# EAGLE design PzemBoard (EAGLE 8.6.0)
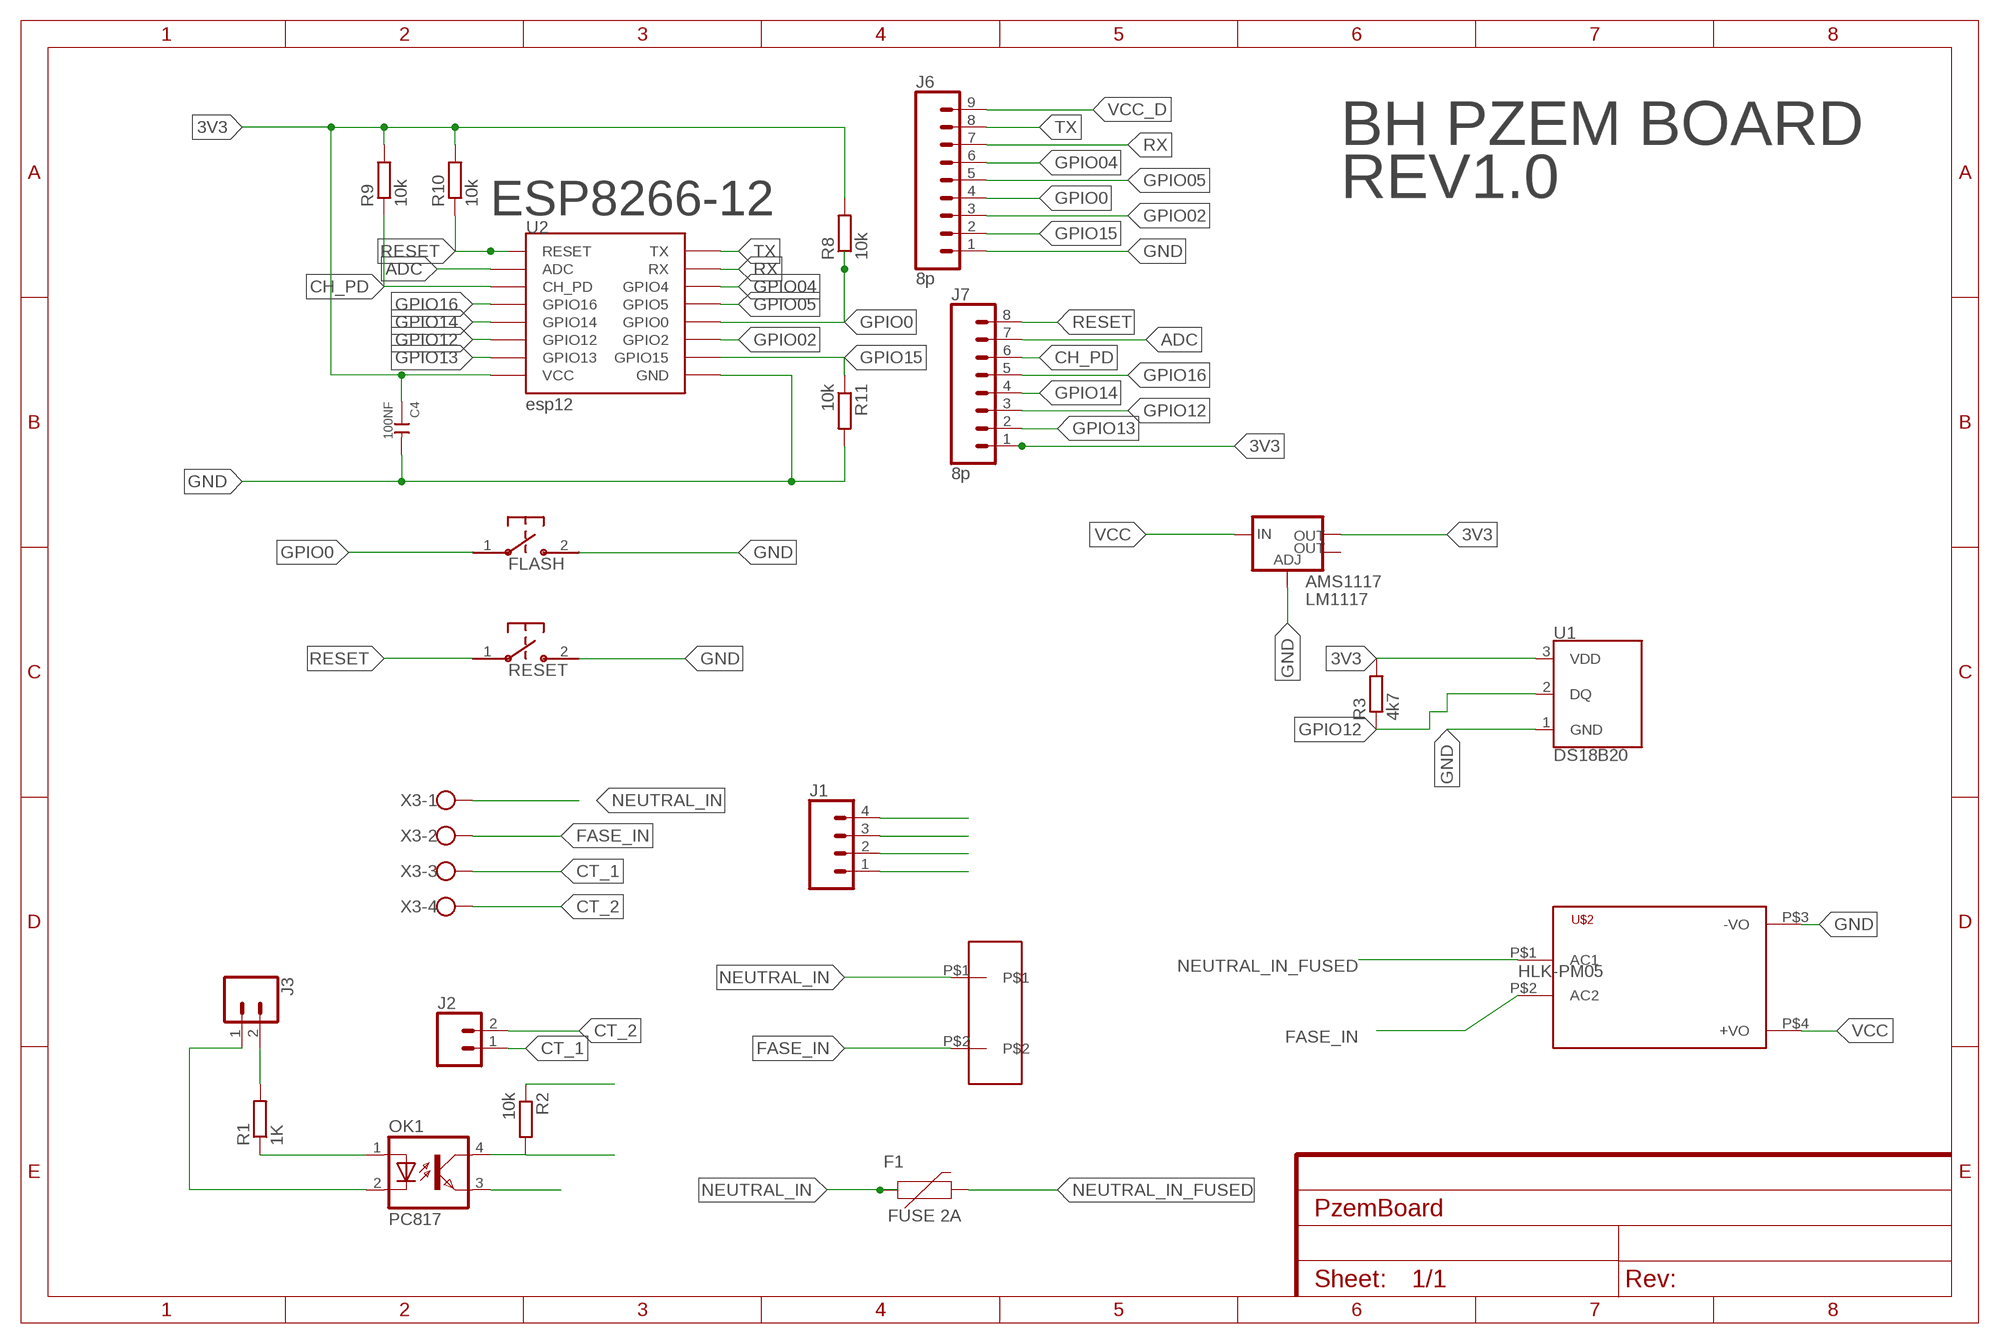
[diagram p0: schematic, sheet 1]

## Parts
AMS1117  LM1117  V_REG_LM1117SOT223  [SOT223]
C4  100NF  CERAMIC-1NF-1KV-10%-X7R(1206)  [C1206]
F1  FUSE 2A  PPTC_PTH  [PTH]
FLASH  B3U-1000P-2P-SMD  B3U-1000P  [B3U-1000P]
J1  CONN_04  [1X04]
J2  CONN_02  [1X02]
J3  CONN_02  [1X02]
J6  8p  CONN_09  [1X09]
J7  8p  CONN_08"  [1X08]
OK1  PC817  [DIL04]
R1  1K  R-EU_R0603  [R0603]
R2  10k  R-EU_R0603  [R0603]
R3  4k7  R-EU_R0603  [R0603]
R8  10k  R-EU_R0603  [R0603]
R9  10k  R-EU_R0603  [R0603]
R10  10k  R-EU_R0603  [R0603]
R11  10k  R-EU_R0603  [R0603]
RESET  B3U-1000P-2P-SMD  B3U-1000P  [B3U-1000P]
U1  DS18B20  [TO-92-AMMO]
U2  esp12  ESP12SMD  [ESP12-SMD]
U$1  SCREWTERMINALS_5MM_2  [TERMINAL_2X]
U$2  HKLPM01  [HKLPM01]
X3  W237-4  [W237-4]

## Nets
3V3: AMS1117.2(OUT) C4.1 J7.1 R3.2 R8.2 R9.2 R10.2 U1.3(VDD) U2.VCC
ADC: J7.7 U2.ADC
CH_PD: J7.6 R9.1 U2.CH_PD
CT_1: J2.1 X3.3
CT_2: J2.2 X3.4
FASE_IN [220V]: U$1.P$2 U$2.P$2(AC2) X3.2
GND: AMS1117.1(ADJ) C4.2 FLASH.2 J1.4 J6.1 OK1.3(EMIT) R11.2 RESET.2 U1.1(GND) U2.GND U$2.P$3(-VO)
GPIO0: FLASH.1 J6.4 R8.1 U2.GPIO0
GPIO02: J6.3 U2.GPIO2
GPIO04: J1.2 J6.6 U2.GPIO4
GPIO05: J1.3 J6.5 U2.GPIO5
GPIO12: J7.3 R3.1 U1.2(DQ) U2.GPIO12
GPIO13: J7.2 U2.GPIO13
GPIO14: J7.4 OK1.4(COL) R2.2 U2.GPIO14
GPIO15: J6.2 R11.1 U2.GPIO15
GPIO16: J7.5 U2.GPIO16
N$1: OK1.1(A) R1.1
N$3: J3.2 R1.2
NEUTRAL_IN [220V]: F1.P$1 U$1.P$1 X3.1
NEUTRAL_IN_FUSED: F1.P$2 U$2.P$1(AC1)
RESET: J7.8 R10.1 RESET.1 U2.RESET
RX: J6.7 U2.RXD0(RX)
SIGNAL_GND: J3.1 OK1.2(C)
TX: J6.8 U2.TXD0(TX)
VCC: AMS1117.3(IN) R2.1 U$2.P$4(+VO)
VCC_D: J1.1 J6.9
Unconnected: AMS1117.4(OUT)

## Notes on the sheet
- BH PZEM BOARD
- REV1.0
- ESP8266-12
- HLK-PM05

## Library data of the parts
AMS1117 = SparkFun-IC-Power:V_REG_LM1117: Voltage Regulator LM1117 Standard adjustable voltage regulator but in SMD form. Spark Fun Electronics SKU : COM-00595; PROD_ID: VREG-08170
C4 = Seeed-Capacitor:CERAMIC-1NF-1KV-10%-X7R?(1206): 302010189; MPN: CC1206KKX7RCBB102; VALUE: 1NF
F1 = SparkFun-Fuses:PPTC: Resettable Fuse PPTC Resettable Fuse. Really a sort of resistor with a polymeric positive temperature coefficient whose resistance increases dramatically with an increase in temperature. When heated by the power passing through the resistance rises causing the current to be limited, protecting the circuit. This is achieved by the transition of the polymer from a crystalline to an amorphous state where the conductive carbon separates breaking the conductive pathways found in the cool crystalline structure. When a PPTC cools back down it resumes conducting letting the circuit turn back on. SparkFun Products: SparkFun RedBoard - Programmed with Arduino <https://www.sparkfun.com/products/12757> Pro Micro - 5V/16MHz <https://www.sparkfun.com/products/12640> Arduino Pro 328 - 5V/16MHz <https://www.sparkfun.com/products/10915> MP3 Trigger <https://www.sparkfun.com/products/13720>; PROD_ID: RES-08490; VALUE: 72V/0.25A
FLASH = switches:B3U: Switch; DIGIKEY: SW1020CT-ND; MANUFACTURER: Omron; MPN: B3U-1000P; SPICEPREFIX: F
J1 = SparkFun-Connectors:CONN_04: Multi connection point. Often used as Generic Header-pin footprint for 0.1 inch spaced/style header connections On any of the 0.1 inch spaced packages, you can populate with these: Break Away Headers - Straight <https://www.sparkfun.com/products/116> (PRT-00116) Break Away Male Headers - Right Angle <https://www.sparkfun.com/products/553> (PRT-00553) Female Headers <https://www.sparkfun.com/products/115> (PRT-00115) Break Away Headers - Machine Pin <https://www.sparkfun.com/products/117> (PRT-00117) Break Away Female Headers - Swiss Machine Pin <https://www.sparkfun.com/products/743> (PRT-00743) For SCREWTERMINALS and SPRING TERMINALS visit here: Screw Terimnals on SparkFun.com <https://www.sparkfun.com/search/results?term=Screw+Terminals> (5mm/3.5mm/2.54mm spacing) This device is also useful as a general connection point to wire up your design to another part of your project. Our various solder wires solder well into these plated through hole pads. Hook-Up Wire - Assortment (Stranded, 22 AWG) <https://www.sparkfun.com/products/11375> (PRT-11375) Hook-Up Wire - Assortment (Solid Core, 22 AWG) <https://www.sparkfun.com/products/11367> (PRT-11367) View the entire wire category on our website here <https://www.sparkfun.com/categories/141> Special notes: Molex polarized connector foot print use with SKU : PRT-08231 with associated crimp pins and housings. 1MM SMD Version SKU: PRT-10208; PROD_ID: CONN-09696
J2 J3 = SparkFun-Connectors:CONN_02: Multi connection point. Often used as Generic Header-pin footprint for 0.1 inch spaced/style header connections On any of the 0.1 inch spaced packages, you can populate with these: Break Away Headers - Straight <https://www.sparkfun.com/products/116> (PRT-00116) Break Away Male Headers - Right Angle <https://www.sparkfun.com/products/553> (PRT-00553) Female Headers <https://www.sparkfun.com/products/115> (PRT-00115) Break Away Headers - Machine Pin <https://www.sparkfun.com/products/117> (PRT-00117) Break Away Female Headers - Swiss Machine Pin <https://www.sparkfun.com/products/743> (PRT-00743) For SCREWTERMINALS and SPRING TERMINALS visit here: Screw Terimnals on SparkFun.com <https://www.sparkfun.com/search/results?term=Screw+Terminals> (5mm/3.5mm/2.54mm spacing) This device is also useful as a general connection point to wire up your design to another part of your project. Our various solder wires solder well into these plated through hole pads. Hook-Up Wire - Assortment (Stranded, 22 AWG) <https://www.sparkfun.com/products/11375> (PRT-11375) Hook-Up Wire - Assortment (Solid Core, 22 AWG) <https://www.sparkfun.com/products/11367> (PRT-11367) View the entire wire category on our website here <https://www.sparkfun.com/categories/141> Special notes: Molex polarized connector foot print use with: PRT-08233 with associated crimp pins and housings. 2.54_SCREWTERM for use with PRT-10571. 3.5mm Screw Terminal footprints for PRT-08084 5mm Screw Terminal footprints for use with PRT-08432
J6 = SparkFun-Connectors:CONN_09: Multi connection point. Often used as Generic Header-pin footprint for 0.1 inch spaced/style header connections On any of the 0.1 inch spaced packages, you can populate with these: Break Away Headers - Straight <https://www.sparkfun.com/products/116> (PRT-00116) Break Away Male Headers - Right Angle <https://www.sparkfun.com/products/553> (PRT-00553) Female Headers <https://www.sparkfun.com/products/115> (PRT-00115) Break Away Headers - Machine Pin <https://www.sparkfun.com/products/117> (PRT-00117) Break Away Female Headers - Swiss Machine Pin <https://www.sparkfun.com/products/743> (PRT-00743) For SCREWTERMINALS and SPRING TERMINALS visit here: Screw Terimnals on SparkFun.com <https://www.sparkfun.com/search/results?term=Screw+Terminals> (5mm/3.5mm/2.54mm spacing) This device is also useful as a general connection point to wire up your design to another part of your project. Our various solder wires solder well into these plated through hole pads. Hook-Up Wire - Assortment (Stranded, 22 AWG) <https://www.sparkfun.com/products/11375> (PRT-11375) Hook-Up Wire - Assortment (Solid Core, 22 AWG) <https://www.sparkfun.com/products/11367> (PRT-11367) View the entire wire category on our website here <https://www.sparkfun.com/categories/141> Special notes: Molex polarized connector foot print use with SKU : PRT-08231 with associated crimp pins and housings. 1MM SMD Version SKU: PRT-10208 NOTES ON THE VARIANTS LOCK and LOCK_LONGPADS... This footprint was designed to help hold the alignment of a through-hole component (i.e. 6-pin header) while soldering it into place. You may notice that each hole has been shifted either up or down by 0.005 of an inch from it's more standard position (which is a perfectly straight line). This slight alteration caused the pins (the squares in the middle) to touch the edges of the holes. Because they are alternating, it causes a "brace" to hold the component in place. 0.005 has proven to be the perfect amount of "off-center" position when using our standard breakaway headers. Although looks a little odd when you look at the bare footprint, once you have a header in there, the alteration is very hard to notice. Also,if you push a header all the way into place, it is covered up entirely on the bottom side.
J7 = SparkFun-Connectors:CONN_08: Multi connection point. Often used as Generic Header-pin footprint for 0.1 inch spaced/style header connections On any of the 0.1 inch spaced packages, you can populate with these: Break Away Headers - Straight <https://www.sparkfun.com/products/116> (PRT-00116) Break Away Male Headers - Right Angle <https://www.sparkfun.com/products/553> (PRT-00553) Female Headers <https://www.sparkfun.com/products/115> (PRT-00115) Break Away Headers - Machine Pin <https://www.sparkfun.com/products/117> (PRT-00117) Break Away Female Headers - Swiss Machine Pin <https://www.sparkfun.com/products/743> (PRT-00743) Arduino Stackable Header - 8 Pin <https://www.sparkfun.com/products/9279> (PRT-09279) For SCREWTERMINALS and SPRING TERMINALS visit here: Screw Terimnals on SparkFun.com <https://www.sparkfun.com/search/results?term=Screw+Terminals> (5mm/3.5mm/2.54mm spacing) This device is also useful as a general connection point to wire up your design to another part of your project. Our various solder wires solder well into these plated through hole pads. Hook-Up Wire - Assortment (Stranded, 22 AWG) <https://www.sparkfun.com/products/11375> (PRT-11375) Hook-Up Wire - Assortment (Solid Core, 22 AWG) <https://www.sparkfun.com/products/11367> (PRT-11367) View the entire wire category on our website here <https://www.sparkfun.com/categories/141> Special notes: Molex polarized connector foot print use with SKU : PRT-08231 with associated crimp pins and housings. 1MM SMD Version SKU: PRT-10208 NOTES ON THE VARIANTS LOCK and LOCK_LONGPADS... This footprint was designed to help hold the alignment of a through-hole component (i.e. 6-pin header) while soldering it into place. You may notice that each hole has been shifted either up or down by 0.005 of an inch from it's more standard position (which is a perfectly straight line). This slight alteration caused the pins (the squares in the middle) to touch the edges of the holes. Because they are alternating, it causes a "brace" to hold the component in place. 0.005 has proven to be the perfect amount of "off-center" position when using our standard breakaway headers. Although looks a little odd when you look at the bare footprint, once you have a header in there, the alteration is very hard to notice. Also,if you push a header all the way into place, it is covered up entirely on the bottom side.; PROD_ID: CONN-08438
OK1 = optocoupler:PC817: SHARP OPTO COUPLER; MPN: PC817X4J000F; OC_FARNELL: 9707727; OC_NEWARK: 97K7059
R1-R3 R8-R11 = resistor:R-EU_: RESISTOR, European symbol
RESET = switches:B3U: Switch; DIGIKEY: SW1020CT-ND; MANUFACTURER: Omron; MPN: B3U-1000P
U1 = SparkFun-Sensors:DS18B20: Dallas/Maxim DS18B20 1-Wire Temperature Sensor The DS18B20 reports degrees C with 9 to 12-bit precision, -55C to 125C (+/-0.5C). Each sensor has a unique 64-Bit Serial number etched into it - allows for a huge number of sensors to be used on one data bus. Datasheet <http://datasheets.maximintegrated.com/en/ds/DS18B20.pdf> SparkFun Products One Wire Digital Temperature Sensor - DS18B20 <https://www.sparkfun.com/products/245> (SEN-00245); STORE_ID: SEN-00245
U2 = esp8266modules:ESP12: ESP8266 Wifi module 12
U$1 = captain-slow:SCREWTERMINALS_5MM_2
U$2 = HKLPM01:HKLPM01
X3 = con-wago-500:W237-4: WAGO SCREW CLAMP; OC_FARNELL: unknown; OC_NEWARK: unknown

## Net classes
1 220V: width 1.27 mm, clearance 2 mm

## Board
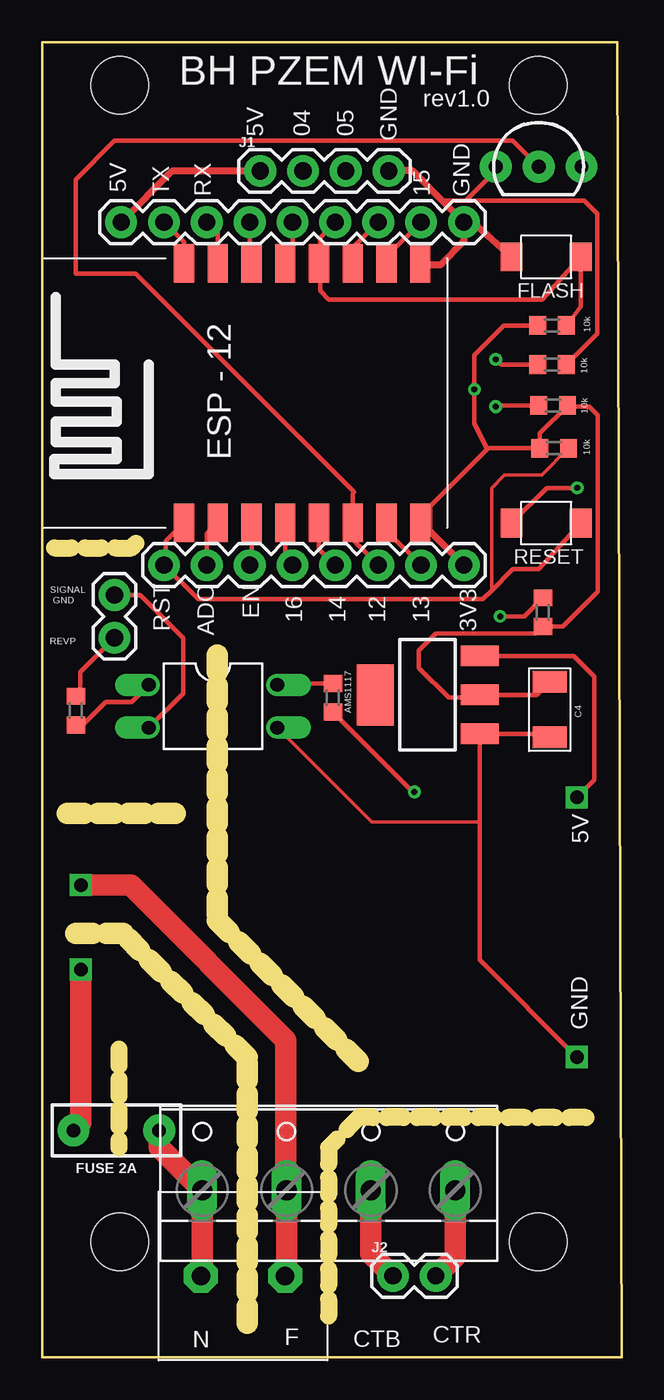
[diagram p1: board, top side]
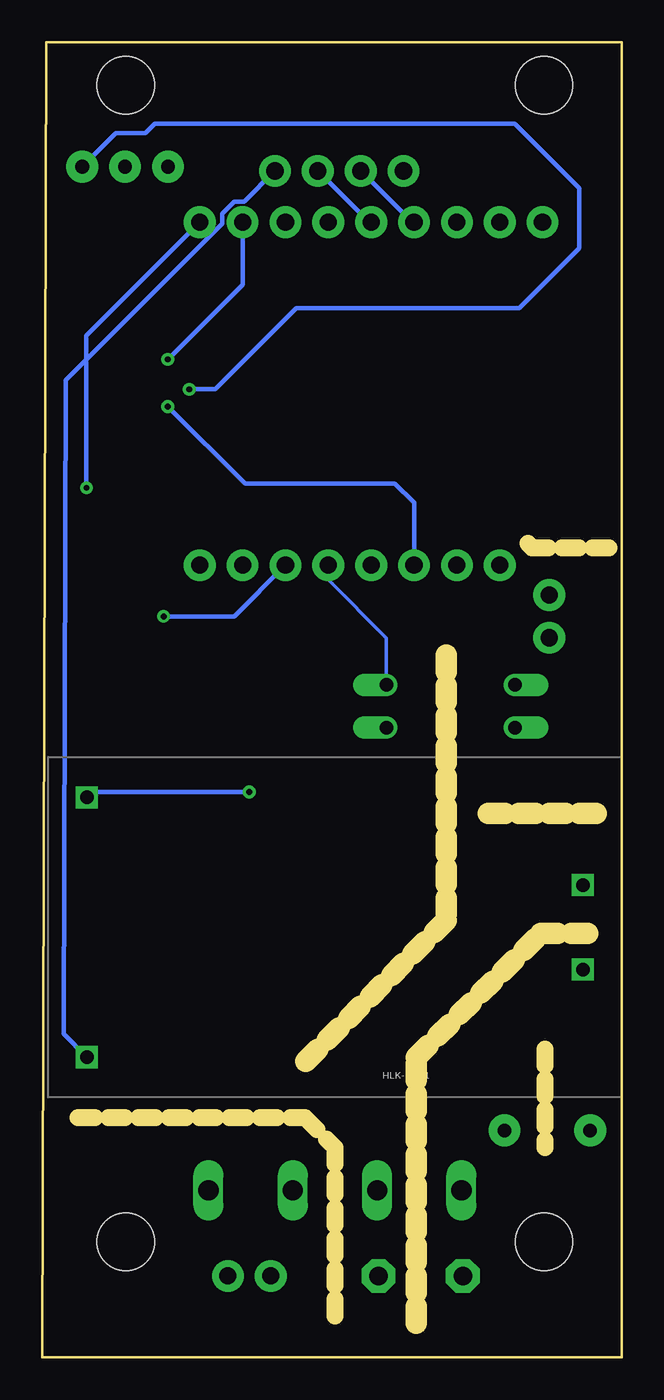
[diagram p2: board, bottom side, seen from below]

Size 34.34 x 77.99 mm. Coordinates in mm from the lower left corner, seen from the top.
Outline: 0,0 0,77.99 34.09,77.99 34.34,0 0,0
Copper layers (1*16): Top 0.035mm / dielectric 1.5mm / Bottom 0.035mm
Design rules "default": minimum track width 6mil, minimum drill 0.35mm, track to track 6mil, track to pad 6mil, pad to pad 6mil, via to via 6mil, smd to smd 6mil, copper to edge 40mil, drill to drill 6mil, minimum pad ring 10mil, minimum via ring 8mil, stop-mask expansion 4mil, vias tented up to drill 0mil, thermal gap 10mil
Holes 3.39 mm at 4.6,6.85 29.4,6.85 29.4,75.44 4.6,75.44
Milling: 61 lines

### Footprints (pad centres in the part's own frame; a part is rotated, then mirrored left to right if it is on the bottom)
SOT223 = smd 1.219 x 2.235: 1 -2.311,-3.099; 2 0,-3.099; 3 2.311,-3.099 | smd 3.6 x 2.2: 4 0,3.099
C1206 = smd 1.27 x 2.032: 1 -1.651,0; 2 1.651,0
PTH = drill 0.8 pad 1.88: P$1 -2.54,0; P$2 2.54,0
B3U-1000P = smd 1.283 x 1.7: 1 -2.056,0; 2 2.056,0
1X04 = drill 1.016 pad 1.88: 1 0,0; 2 2.54,0; 3 5.08,0; 4 7.62,0
1X02 = drill 1.016 pad 1.88: 1 0,0; 2 2.54,0
1X09 = drill 1.016 pad 1.88: 1 0,0; 2 2.54,0; 3 5.08,0; 4 7.62,0; 5 10.16,0; 6 12.7,0; 7 15.24,0; 8 17.78,0; 9 20.32,0
1X08 = drill 1.016 pad 1.88: 1 0,0; 2 2.54,0; 3 5.08,0; 4 7.62,0; 5 10.16,0; 6 12.7,0; 7 15.24,0; 8 17.78,0
DIL04 = drill 0.813 offset: 1 -1.27,-3.81; 2 1.27,-3.81; 3 1.27,3.81; 4 -1.27,3.81
R0603 = smd 1 x 1.1: 1 -0.85,0; 2 0.85,0
TO-92-AMMO = drill 0.813 pad 1.88: 1 -2.54,0; 2 0,0; 3 2.54,0
ESP12-SMD = smd 2.286 x 1.2: ADC -7.792,3.8; CH_PD -7.792,1.8; GND 7.592,-8.2; GPIO0 7.592,-2.2; GPIO2 7.592,-4.2; GPIO4 7.592,1.8; GPIO5 7.592,-0.2; GPIO12 -7.792,-4.2; GPIO13 -7.792,-6.2; GPIO14 -7.792,-2.2; GPIO15 7.592,-6.2; GPIO16 -7.792,-0.2; RESET -7.792,5.8; RXD0 7.592,3.8; TXD0 7.592,5.8; VCC -7.792,-8.2
TERMINAL_2X = drill 1.1 pad 2 octagon: P$1 0,2.5; P$2 0,-2.5
HKLPM01 = drill 0.8 square: P$1 -14.7,2.5; P$2 -14.7,-2.5; P$3 14.7,7.7; P$4 14.7,-7.7
W237-4 = drill 1.194 long: 1 -7.5,-1.27; 2 -2.5,-1.27; 3 2.5,-1.27; 4 7.5,-1.27

### Placement (x,y rotation side)
AMS1117  22.84,39.29 90 top
C4  30.09,38.42 270 top
F1  4.4,13.46 180 top
FLASH  29.87,65.26 180 top
J1  12.92,70.36 0 top
J2  20.8,4.83 0 top
J3  4.29,45.21 270 top
J6  25,67.31 180 top
J7  25,46.98 180 top
OK1  10.13,38.61 270 top
R1  2,38.35 90 top
R2  17.24,39.12 90 top
R3  29.69,44.2 270 top
R8  30.22,61.19 180 top
R9  30.29,56.45 0 top
R10  30.35,53.91 180 top
R11  30.22,58.87 0 top
RESET  29.87,49.47 180 top
U1  29.43,70.61 0 top
U2  14.21,57.28 90 top
U$1  11.91,4.83 90 top
U$2  16.99,25.5 180 bottom
X3  16.99,11.18 0 top

### Tracks (layer width: path | path; a pad name or v marks a point on that pad's centre or on a via)
3V3  (via drill 0.35)
  Top 0.254: 26.38,53.85 25.62,55.37 v25.62,57.4 25.62,59.44 27.38,61.19 R8.2 | 26.38,53.85 26.44,53.91 R10.2 29.5,54.8 R9.2 31.2,56.39 32.43,56.39 32.94,55.88 32.94,45.42 30.87,43.35 R3.2 29.27,42.93 23.34,42.93 22.32,41.91 22.32,40.89 24.1,39.12 25.96,39.12 26.13,39.28 | 26.38,53.85 23.02,50.48 23.02,48.96 | AMS1117.2 26.13,39.28 | 26.13,39.28 29.3,39.28 C4.1
  Top 0.406: U2.VCC 22.49,49.49 23.02,48.96 J7.1
  Bottom 0.254: U1.3 29.98,72.6 28.22,72.6 27.68,73.15 6.32,73.15 2.51,69.34 2.51,65.79 6.06,62.23 19.27,62.23 24.1,57.4 v25.62,57.4
ADC
  Top 0.254: U2.ADC 9.76,48.84 J7.7
CH_PD  (via drill 0.35)
  Top 0.254: U2.CH_PD 12.41,47.09 J7.6 | R9.1 26.95,56.45 v26.89,56.39
  Bottom 0.254: v26.89,56.39 22.32,51.82 13.43,51.82 12.3,50.69 J7.6
CT_1
  Top 1.27: X3.3 19.49,6.14 J2.1
CT_2
  Top 1.27: X3.4 24.49,5.98 J2.2
FASE_IN
  Top 1.27: U$1.P$2 14.49,4.91 X3.2 14.45,9.95 14.45,18.8 5.24,28 U$2.P$2
GND  (via drill 0.35)
  Top 0.2: 25.94,31.75 19.53,31.75 OK1.3
  Top 0.254: U$2.P$3 25.94,23.55 25.94,31.75 AMS1117.1 29.88,36.97 C4.2 | RESET.2 29.91,51.56 v31.72,51.56 | R11.2 32.9,60.7 32.9,67.82 32.14,68.58 25.11,68.58 | 23.54,68.78 23.73,68.58 25.11,68.58 | U1.1 26.89,70.36 25.11,68.58
  Top 0.406: J6.1 25.51,67.31 FLASH.2 | J6.1 23.54,68.78 21.95,70.36 J1.4 | J6.1 25,66.18 23.59,64.77 22.51,64.77 U2.GND
  Bottom 0.254: v31.72,51.56 31.72,60.59 J6.1 | J1.4 22.37,68.53 22.96,68.53 23.68,67.82 23.68,67.22 32.94,57.96 33.06,19.56 33.06,19.17 U$2.P$3
GPIO0
  Top 0.254: J6.4 16.48,66.41 16.48,64.94 | 16.48,64.94 U2.GPIO0 | R8.1 31.93,62.3 FLASH.1 29.66,62.74 16.99,62.74 16.48,63.25 16.48,64.94
GPIO02
  Top 0.254: J6.3 18.41,65.8 U2.GPIO2
GPIO04
  Top 0.254: J6.6 12.3,64.98 U2.GPIO4
  Bottom 0.254: J1.2 12.42,67.31 J6.6
GPIO05
  Top 0.254: J6.5 14.84,65.3 U2.GPIO5
  Bottom 0.254: J1.3 14.96,67.31 J6.5
GPIO12  (via drill 0.35)
  Top 0.254: J7.3 18.41,48.49 18.41,49.02 U2.GPIO12 18.41,51.21 18.51,51.31 5.56,64.26 2,64.26 2,69.85 4.29,72.14 27.91,72.14 U1.2 | R3.1 28.58,43.94 v27.15,43.94
  Bottom 0.254: v27.15,43.94 22.95,43.94 J7.3
GPIO13
  Top 0.254: U2.GPIO13 20.41,49.03 J7.2
GPIO14
  Top 0.254: U2.GPIO14 16.41,47.95 J7.4 | OK1.4 14.03,39.97 R2.2
  Bottom 0.2: OK1.4 13.94,42.67 17.38,46.11 J7.4
GPIO15  (via drill 0.35)
  Top 0.254: J6.2 20.41,65.26 U2.GPIO15 | R11.1 27.2,58.87 v26.89,59.18
  Bottom 0.254: v26.89,59.18 22.46,63.61 J6.2
GPIO16
  Top 0.254: U2.GPIO16 14.41,47.41 J7.5
N$1
  Top 0.254: OK1.1 5.3,38.86 3.78,38.86 2.42,37.5 R1.1
N$3
  Top 0.254: J3.2 2.25,40.64 2.25,39.46 R1.2
NEUTRAL_IN
  Top 1.27: F1.P$1 6.94,12.45 X3.1 9.49,4.91 U$1.P$1
NEUTRAL_IN_FUSED
  Top 1.27: U$2.P$1 2.29,13.89 F1.P$2
RESET
  Top 0.203: R10.1 29.61,52.32 27.4,52.32 26.64,51.56 26.64,45.47
  Top 0.254: U2.RESET 7.33,48.41 7.33,47.09 J7.8 9.24,44.96 26.13,44.96 26.64,45.47 27.91,46.74 29.45,46.74 RESET.1
RX
  Top 0.254: J6.7 10.41,66.66 U2.RXD0
SIGNAL_GND
  Top 0.254: OK1.2 8.35,39.37 8.35,42.67 5.81,45.21 J3.1
TX
  Top 0.254: J6.8 8.41,66.12 U2.TXD0
VCC  (via drill 0.35)
  Top 0.254: AMS1117.3 31.52,41.6 32.73,40.39 32.73,34.24 U$2.P$4 | R2.1 21.98,33.53 v22.07,33.53
  Bottom 0.254: v22.07,33.53 31.37,33.53 U$2.P$4
VCC_D
  Top 0.406: J6.9 7.72,70.36 J1.1

### Text on the board
tNames: BH PZEM WI-Fi | rev1.0 | 5V | 04 | 05 | GND | 5V | TX | RX | 15 | GND | SIGNAL / GND | EN | 16 | 14 | 12 | 13 | REVP | RST | ADC | 3V3 | 5V | GND | CTB | N | F | CTR
bNames: HLK-PM01